# Altium schematic sheet Sheet_SmartTerminal_2024-09-08.schdoc
size 307 x 166 mm
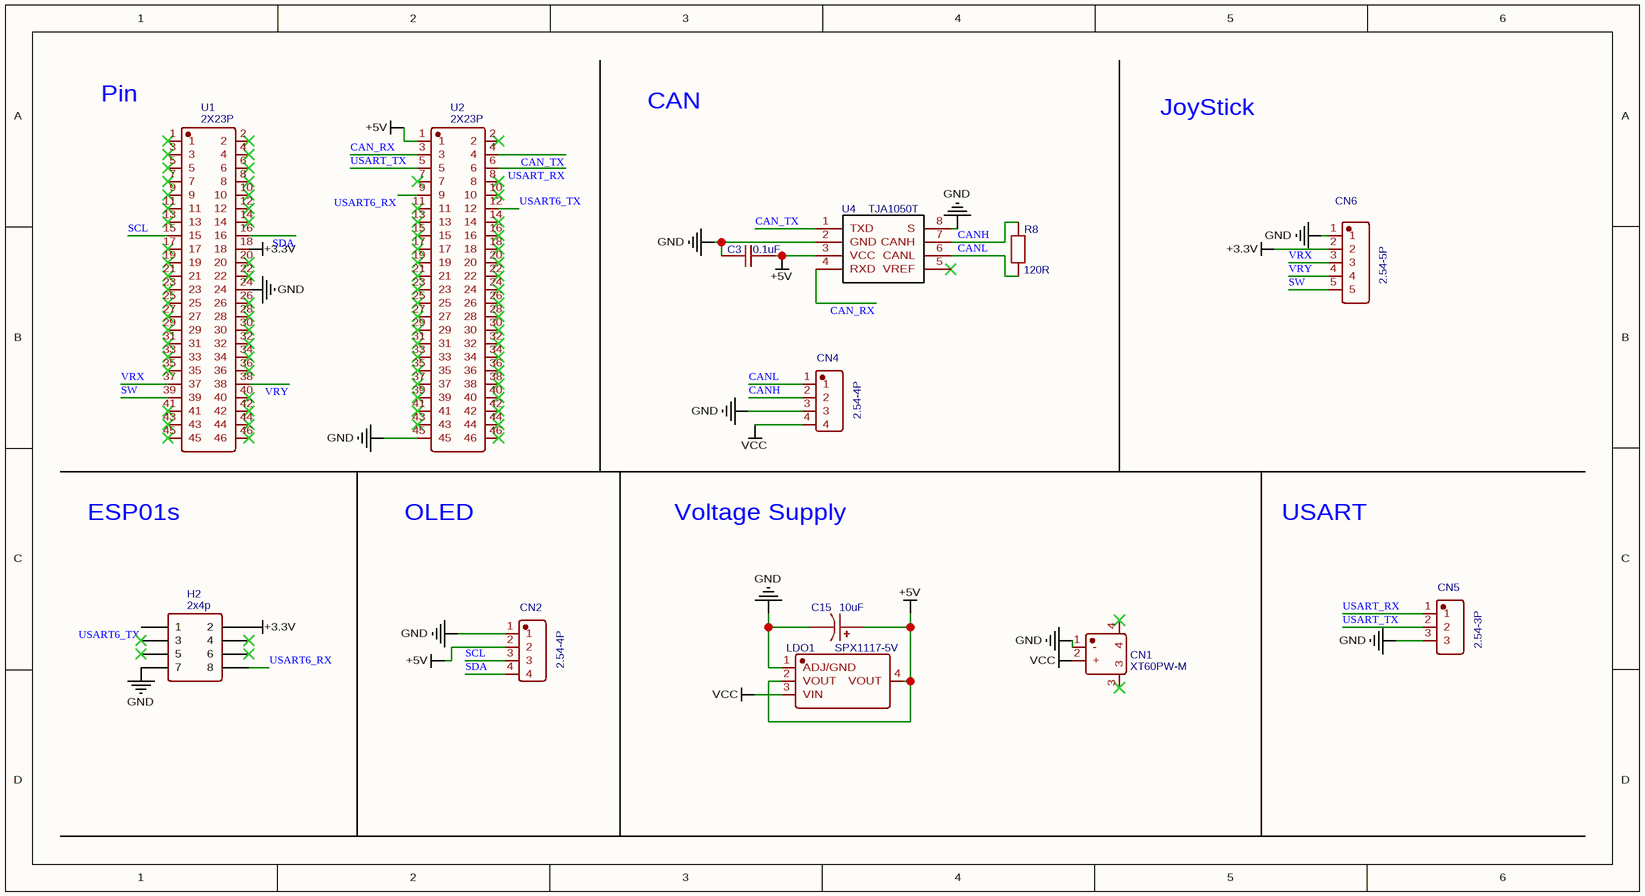
[diagram p0: Sheet_SmartTerminal_2024-09-08.schdoc]

## Parts
C3  0.1uF  [C0603]
C15  10uF  [CASE-A_3216]
CN1  XT60PW-M  [CONN-TH_XT60PW-M]
CN2  2.54-4P  [CONN-TH_XH-4AW]
CN4  2.54-4P  [CONN-TH_XH-4AW]
CN5  2.54-3P  [CONN-TH_3P-P2.54_HCTL_XH-3AW]
CN6  2.54-5P  [CONN-TH_5P-P2.54_XH-5AW_C2908614]
H2  2x4p  [HDR-TH_8P-P2.54-V-F-R2-C4-S2.54]
LDO1  SPX1117-5V  [SOT-223-4_L6.5-W3.5-P2.30-LS7.0-BR]
R8  120R  [R0603]
U1  2X23P  [HDR-TH_46P-P2.54-V-M-R2-C23-S2.54]
U2  2X23P  [HDR-TH_46P-P2.54-V-M-R2-C23-S2.54]
U4  TJA1050T  [SOIC-8_L5.0-W4.0-P1.27-LS6.0-BL]

## Nets
+3.3V: CN6.2 H2.2 U1.18
+5V: C3.2 C15.1 CN2.2 LDO1.2(VOUT) LDO1.4(VOUT) U2.1 U4.3(VCC)
GND: C3.1 C15.2 CN1.1(-) CN2.1 CN4.3 CN5.3 CN6.1 H2.7 LDO1.1(ADJ/GND) U1.24 U2.45 U4.2(GND) U4.8(S)
VCC: CN1.2(+) CN4.4 LDO1.3(VIN)
CAN_RX: U2.3 U4.4(RXD)
CAN_TX: U2.4 U4.1(TXD)
CANH: CN4.2 R8.2 U4.7(CANH)
CANL: CN4.1 R8.1 U4.6(CANL)
SCL: CN2.3 U1.15
SDA: CN2.4 U1.16
SW: CN6.5 U1.39
USART6_RX: H2.8 U2.9
USART6_TX: H2.1 U2.12
USART_RX: CN5.1 U2.6
USART_TX: CN5.2 U2.5
VRX: CN6.3 U1.37
VRY: CN6.4 U1.38

Not connected (* = marked no-connect by the designer): CN1 3* 4*; H2 3* 4* 5* 6*; U1 1* 2* 3* 4* 5* 6* 7* 8* 9* 10* 11* 12* 13* 14* 17* 19* 20* 21* 22* 23* 25* 26* 27* 28* 29* 30* 31* 32* 33* 34* 35* 36* 40* 41* 42* 43* 44* 45* 46*; U2 2* 7* 8* 10* 11* 13* 14* 15* 16* 17* 18* 19* 20* 21* 22* 23* 24* 25* 26* 27* 28* 29* 30* 31* 32* 33* 34* 35* 36* 37* 38* 39* 40* 41* 42* 43* 44* 46*; U4 5(VREF)*

## Notes on the sheet
- Pin
- CAN
- JoyStick
- ESP01s
- OLED
- Voltage Supply
- USART

## Library data of the parts
C3 = 0.1uF: nameAlias: Value(F); Contributor: LCEDA_Lib; spicePre: C; spiceSymbolName: C_0603_US
C15 = 10uF: nameAlias: Value(F); Contributor: LCEDA_Lib; spicePre: C; spiceSymbolName: C_Tan_SMD_A_US
CN1 = XT60PW-M: Manufacturer: AMASS(艾迈斯); Contributor: LCSC; Supplier: LCSC; Supplier Part: C98732; Manufacturer Part: XT60PW-M; JLCPCB Part Class: Extended Part; spicePre: C; spiceSymbolName: XT60PW-M
CN2 CN4 = 2.54-4P: Manufacturer: HCTL(华灿天禄); Manufacturer Part: XH-4AW; Contributor: LCSC; Supplier: LCSC; Supplier Part: C2908613; JLCPCB Part Class: Extended Part; spicePre: C; spiceSymbolName: XH-4AW_C2908613
CN5 = 2.54-3P: Manufacturer: HCTL(华灿天禄); Manufacturer Part: XH-3AW; Contributor: LCSC; Supplier: LCSC; Supplier Part: C2908612; JLCPCB Part Class: Extended Part; spicePre: C; spiceSymbolName: XH-3AW_C2908612
CN6 = 2.54-5P: Manufacturer: HCTL(华灿天禄); Manufacturer Part: XH-5AW; Contributor: LCSC; Supplier: LCSC; Supplier Part: C2908614; JLCPCB Part Class: Extended Part; spicePre: C; spiceSymbolName: XH-5AW_C2908614
H2 = 2x4p: Manufacturer: CONNFLY; Manufacturer Part: DS1023-2*4SF11; Contributor: LCSC; Supplier: LCSC; Supplier Part: C92271; JLCPCB Part Class: Extended Part; spicePre: H; spiceSymbolName: DS1023-2*4SF11
LDO1 = SPX1117-5V: BOM_Manufacturer: MaxLinear; BOM_Manufacturer Part: SPX1117M3-L/TR; BOM_Supplier: LCSC; BOM_Supplier Part: C67402; BOM_JLCPCB Part Class: Extended Part; spicePre: L; spiceSymbolName: SPX1117M3-L/TR
R8 = 120R: nameAlias: Value(Ω); Contributor: LCEDA_Lib; spicePre: R; spiceSymbolName: R_0603_EU
U1 U2 = 2X23P: Manufacturer: XKB Connection(中国星坤); Manufacturer Part: X6522WV-2x23H-C60D30-E80; Contributor: lcsc; Supplier: LCSC; Supplier Part: C5242097; spicePre: U; spiceSymbolName: X6522WV-2X23H-C60D30-E80
U4 = TJA1050T: BOM_Manufacturer: NXP(恩智浦); BOM_Manufacturer Part: TJA1050T/CM,118; BOM_Supplier: LCSC; BOM_Supplier Part: C6952; BOM_JLCPCB Part Class: Basic Part; spicePre: U; spiceSymbolName: TJA1050T/CM,118